# Altium schematic sheet Power.SchDoc: Power
size A4; CheckedBy: DMH; Organization: Detex Corp; Address1: Detex Corp; Address2: 302 Detex Dr; Address3: New Braunfels, TX 78130; Address4: (830) 629-290; DocumentNumber: 107027; Revision: A1; SheetNumber: 4; SheetTotal: 5; ProjectName: EE Project - 1.17.2021.PrjPcb
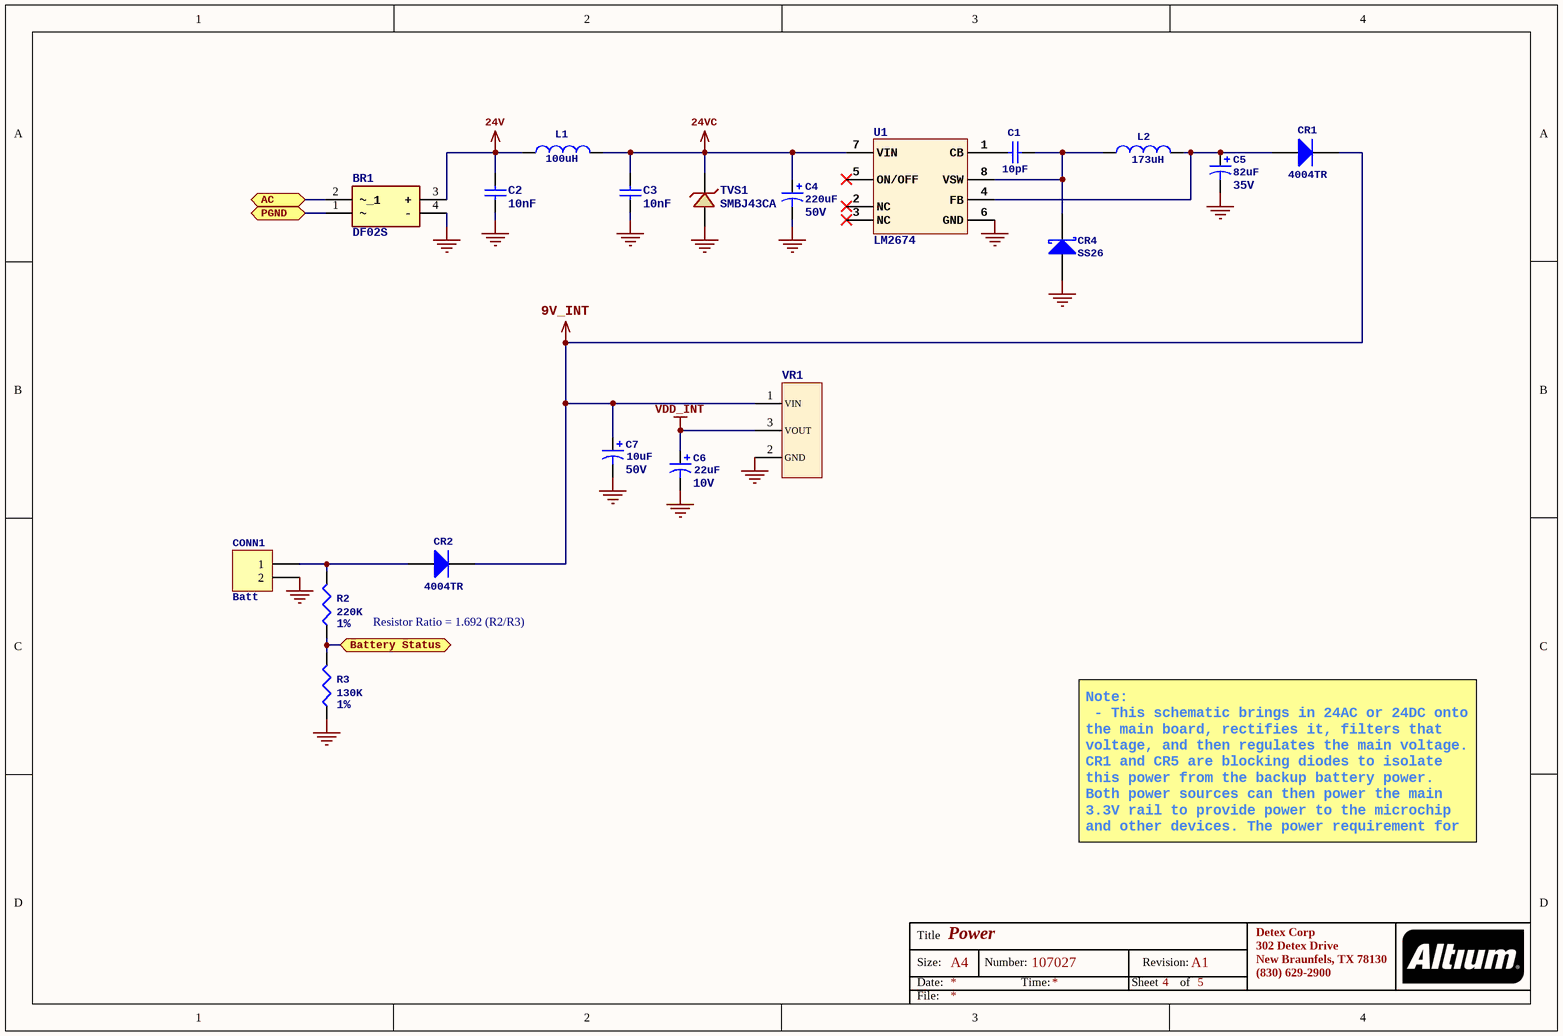
[diagram p0: Power.SchDoc]

## Parts
BR1  DF02S  [SOP520P1005X363-4N]
C1  value 10pF  [C0805]  (hidden comment: Cap)
C2  value 10nF  [C0805]  (hidden comment: Cap)
C3  value 10nF  [C0805]  (hidden comment: Cap)
C4  value 220uF  Voltage: 50V  [10x12.5 CAP]  (hidden comment: Cap Pol3)
C5  value 82uF  Voltage: 35V  [6.3x15 Cap]  (hidden comment: Cap Pol3)
C6  value 22uF  Voltage: 10V  [C0805]  (hidden comment: Cap Pol3)
C7  value 10uF  Voltage: 50V  [CAP 1206_3216 - 1.2MM]  (hidden comment: Cap 1206)
CONN1  Batt  [BAT-2]  (no BOM)
CR1  MFR P/N: 4004TR  [DIODE SMA]  (hidden comment: Diode)
CR2  MFR P/N: 4004TR  [DIODE SMA]  (hidden comment: Diode)
CR4  MFR P/N: SS26  [SMB]  (hidden comment: D Schottky)
L1  value 100uH  [AXIAL-0.5]  (hidden comment: Inductor)
L2  value 173uH  [PE-53819NL]  (hidden comment: Inductor)
R2  1%  value 220K  [6-0805_N]
R3  1%  value 130K  [6-0805_N]
TVS1  SMBJ43CA  [SMBJSeries_LTF]
U1  LM2674  [SOIC127P600X175-8N]
VR1  (no value)  [VXO78-1000]

## Ports
AC (bidir), Battery Status (bidir), PGND (bidir)

## Nets
9V_INT: C7.1 CR1.2(K) CR2.2(K) VR1.1(VIN)
24V: BR1.3(+) C2.1 L1.1
24VC: C3.1 C4.1 L1.2 TVS1.1 U1.7(VIN)
GND: BR1.4(-) C2.2 C3.2 C4.2 C5.2 C6.2 C7.2 CONN1.2 CR4.1(A) R3.1 TVS1.2 U1.6(GND) VR1.2(GND)
VDD_INT: C6.1 VR1.3(VOUT)
AC: BR1.2(~_1) ; port AC
Battery Status: R2.1 R3.2 ; port Battery Status
PGND: BR1.1 ; port PGND
NetC1_1: C1.1 CR4.2(K) L2.1 U1.8(VSW)
NetC1_2: C1.2 U1.1(CB)
NetC5_1: C5.1 CR1.1(A) L2.2 U1.4(FB)
NetCONN1_1: CONN1.1 CR2.1(A) R2.2

Not connected (* = marked no-connect by the designer): U1 2(NC)* 3(NC)* 5(ON/OFF)*

## Notes on the sheet
- Resistor Ratio = 1.692 (R2/R3)
- Note:
  - This schematic brings in 24AC or 24DC onto the main board, rectifies it, filters that voltage, and then regulates the main voltage. CR1 and CR5 are blocking diodes to isolate this power from the backup battery power. Both power sources can then power the main 3.3V rail to provide power to the microchip and other devices. The power requirement for these supplys is to provide a nominal voltage of 9V.
- Title
- Size:
- Date:
- A4
- Number:
- Time:
- Sheet
- Revision:
- of
- Detex Corp
- 302 Detex Drive
- New Braunfels, TX 78130
- (830) 629-2900
- File:

## Library data of the parts
BR1 = DF02S: Bridge Rectifier; MFR: Vishay; Height: 3.63mm; MFR P/N: DF02S; ComponentLink1Description: Datasheet; ComponentLink1URL: http://www.vishay.com/docs/88573/dfs.pdf; Mounting Technology: SMT
C1 = Cap: Capacitor; PackageReference: 0805; Detex P/N: *; Case/Package: 0805; Mounting Technology: SMT; PACKAGE: 0805
C2 C3 = CMP-001-00016-4: Capacitor Ceramic X7R 50V 10nF 0805; Tolerance: 10%; Detex P/N: 101727-12; Voltage Rating: 50V; Pins: 2; Case/Package: 1206; Mounting Technology: SMT; PACKAGE: 1206
C4 = Cap Pol3: Polarized Capacitor (Surface Mount); Detex P/N: 103517-221; ComponentLink1Description: Datasheet; ComponentLink1URL: http://products.nichicon.co.jp/en/pdf/XJA043/e-uvz.pdf; PACKAGE: 10x12.5 50V radial capacitor; Mounting Technology: Thru-Hole
C5 = Cap Pol3: Polarized Capacitor (Surface Mount); MFR: Panasonic; MFR P/N: EEUFC1V820; Detex P/N: 102102-2; ComponentLink1Description: Datasheet; ComponentLink1URL: http://www.farnell.com/datasheets/1901197.pdf; PACKAGE: 6.3x15 35V radial capacitor; Mounting Technology: Thru-Hole
C6 = Cap Pol3: Multilayer Ceramic Capacitors MLCC - SMD/SMT 22UF 10V 20% 0805; MFR: Murata Electronics; MFR P/N: GRM21BR61A226ME51L; ComponentLink1Description: Datasheet; ComponentLink1URL: http://www.farnell.com/datasheets/1901197.pdf; PACKAGE: 0805; Detex P/N: *; PackageReference: 0805; Case/Package: 0805; Mounting Technology: SMT
C7 = Cap Pol3: Multilayer Ceramic Capacitors MLCC - SMD/SMT 1206 50V 10uF 10% AEC-Q200; MFR: TDK; MFR P/N: CGA5L1X7R1H106K160AC; ComponentLink1Description: Datasheet; ComponentLink1URL: https://product.tdk.com/info/en/catalog/datasheets/mlcc_automotive_general_en.pdf?ref_disty=mouser; PACKAGE: 1206; Detex P/N: *; PackageReference: 1206; Case/Package: 1206; Mounting Technology: SMT
CONN1 = Header 2: Header, 2-Pin; ComponentLink1Description: Datasheet; Detex P/N: *
CR1 CR2 = Diode: Default Diode; Detex P/N: PP-5970-2; ComponentLink1Description: Datasheet; PACKAGE: DO-214AB; Case/Package: DO-214AB; Mounting Technology: SMT
CR4 = D Schottky: Schottky Barrier Rectifier; MFR: VIshay; Detex P/N: 101672-2; ComponentLink1Description: Datasheet; ComponentLink1URL: http://www.vishay.com/docs/88748/ss22.pdf; PACKAGE: SMB; Case/Package: SMB; Mounting Technology: SMT
L1 = Inductor: MFR: Fastron; MFR P/N: SMCC/N-101J-01; Detex P/N: 101673-2; ComponentLink1Description: Datasheet; ComponentLink1URL: http://www.fastrongroup.com/image-show/72/SMCC.pdf?type=Complete-DataSheet&productType=series; PACKAGE: Leaded Inductor; Mounting Technology: Thru-Hole
L2 = Inductor: MFR: Pulse; MFR P/N: PE-53819; Detex P/N: 102104-1; ComponentLink1Description: Datasheet; ComponentLink1URL: http://products.pulseelex.com/files/product_files/SPM2007_47.pdf; PACKAGE: Toroid Inductor THT; Mounting Technology: Thru-Hole
R2 = Res3: Resistor 220K Ohm 1% 0805 SMT; Detex P/N: 101734-23; ComponentLink1Description: Datasheet; PACKAGE: 0805 SMD 1/8W; Case/Package: 0805; Mounting Technology: SMT
R3 = Res3: Resistor 130K Ohm 1% 0805 SMT; MFR: Vishay/Dale; MFR P/N: CRCW0805130KFKEA; Detex P/N: 101734-X; ComponentLink1Description: Datasheet; PACKAGE: 0805 SMD 1/8W; Case/Package: 0805; Mounting Technology: SMT
TVS1 = SMBJ43CA: 69.4V Clamp 8.7A Ipp Tvs Diode Surface Mount DO-214AA (SMBJ); MFR: Littelfuse Inc; Detex P/N: 103516-43; MFR P/N: SMBJ43CA; Package: DO214AA; ComponentLink1Description: Datasheet; ComponentLink1URL: https://www.littelfuse.com/~/media/electronics/datasheets/tvs_diodes/littelfuse_tvs_diode_smbj_datasheet.pdf.pdf; Mounting Technology: SMT; PackageReference: SMB
U1 = LM2674M-12: IC REG BUCK 12V 0.5A 8-SOIC; Detex P/N: 102101-1; Case/Package: SOIC-8; MFR P/N: LM2674; Mounting Technology: SMT; PackageReference: SOIC-8; PACKAGE: SOIC-8
VR1 = DC-DC Converter: MFR: CUI; ComponentLink1Description: Datasheet; ComponentLink1URL: https://www.cui.com/product/resource/vxo78-1000.pdf; Detex P/N: *; Case/Package: SIP3; MFR P/N: VXO78-1000; Mounting Technology: Thru-Hole; PACKAGE: SIP3